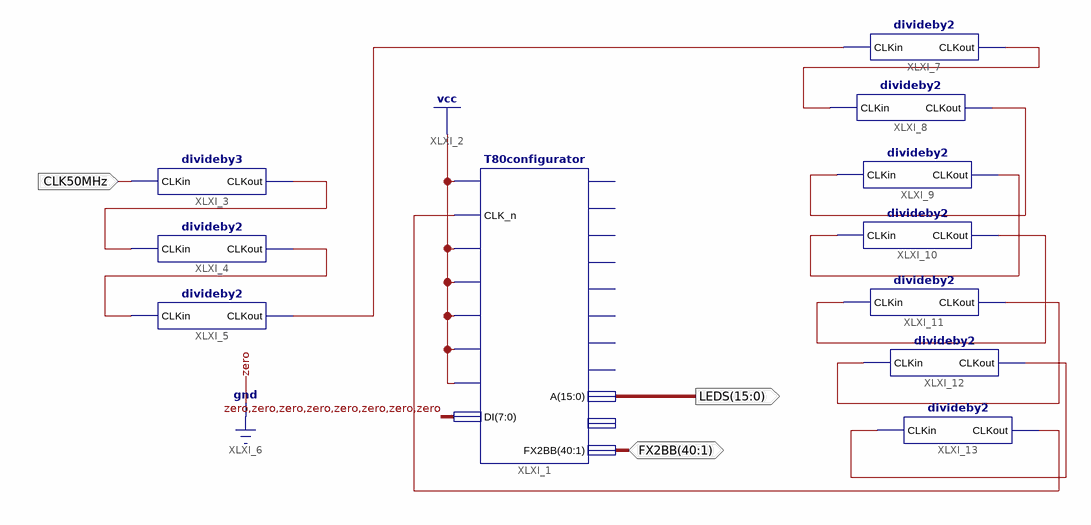
[diagram p0: schematic sheet 1]
// Xilinx ISE schematic Z80fx2bb_test.sch (spartan3e) as structural Verilog: 11 symbols, 3 ports
module Z80fx2bb_test (
  input  CLK50MHz,
  inout  [40:1] FX2BB,
  output [15:0] LEDS
);

  wire XLXN_7, XLXN_8, XLXN_10, XLXN_11, XLXN_12, XLXN_13, XLXN_14, XLXN_15, XLXN_16, XLXN_17;

  T80configurator XLXI_1 (
    .RESET_n(1'b1), .CLK_n(XLXN_17), .CLKEN(1'b1), .WAIT_n(1'b1), .INT_n(1'b1), .NMI_n(1'b1), .BUSRQ_n(1'b1),
    .DI({8{1'b0}}), .FX2BB(FX2BB), .A(LEDS));  // open: M1_n, MREQ_n, IORQ_n, RD_n, WR_n, RFSH_n, HALT_n, BUSAK_n, DO
  divideby3 XLXI_3 (.CLKin(CLK50MHz), .CLKout(XLXN_7));
  divideby2 XLXI_4 (.CLKin(XLXN_7), .CLKout(XLXN_8));
  divideby2 XLXI_5 (.CLKin(XLXN_8), .CLKout(XLXN_10));
  divideby2 XLXI_7 (.CLKin(XLXN_10), .CLKout(XLXN_11));
  divideby2 XLXI_8 (.CLKin(XLXN_11), .CLKout(XLXN_12));
  divideby2 XLXI_9 (.CLKin(XLXN_12), .CLKout(XLXN_13));
  divideby2 XLXI_10 (.CLKin(XLXN_13), .CLKout(XLXN_14));
  divideby2 XLXI_11 (.CLKin(XLXN_14), .CLKout(XLXN_15));
  divideby2 XLXI_12 (.CLKin(XLXN_15), .CLKout(XLXN_16));
  divideby2 XLXI_13 (.CLKin(XLXN_16), .CLKout(XLXN_17));
endmodule
